# Altium schematic sheet LPCB219 - REFLECT SENSORS.SchDoc
size A3; Address1: Factory 10; Address2: 9-13 Dingley Avenue, Dandeong, VICTORIA 3175, AUSTRALIA; DocumentNumber: 6; Revision: 1; SheetNumber: 6; SheetTotal: 7; Lockie__PCB_SUB_ASSEMBLY: Reflect Sensors; Lockie__PCB_ASSEMBLY: Main; Lockie__LDL: LPCB219; Lockie__PCB_DESCRIPTION: Control Node
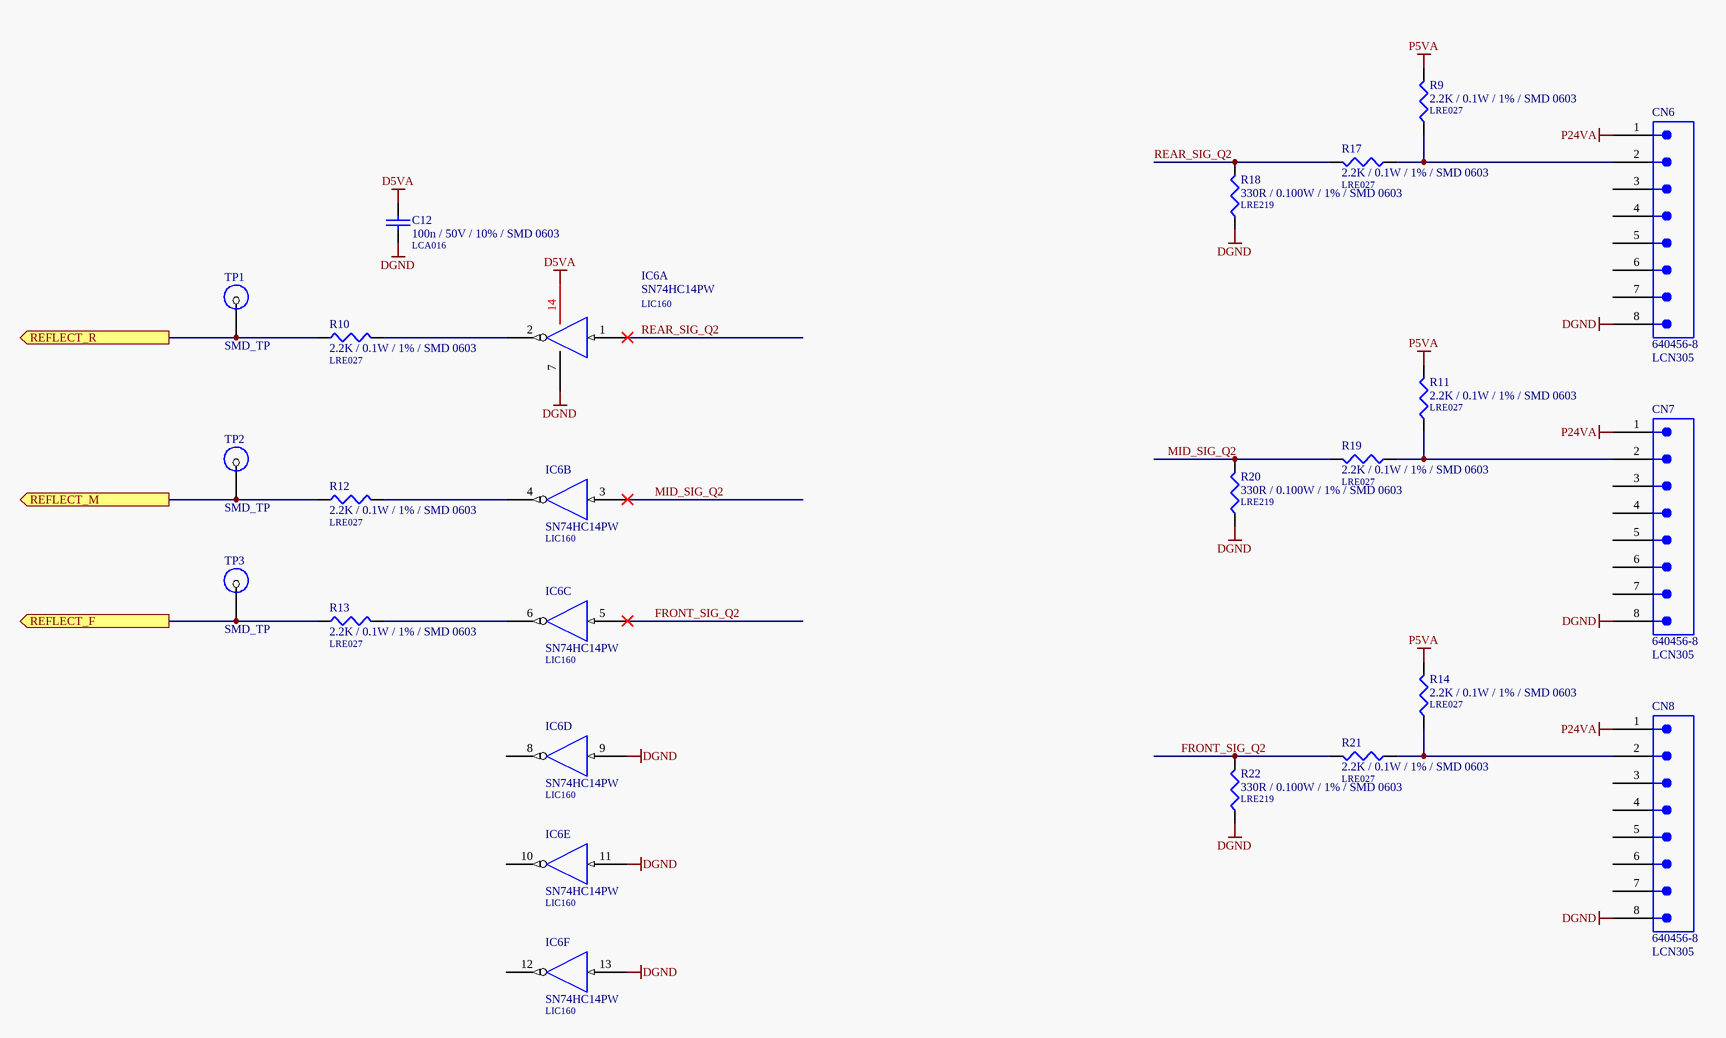
[diagram p0: LPCB219 - REFLECT SENSORS.SchDoc]

## Parts
C12  100n / 50V / 10% / SMD 0603  LDL_NUMBER: LCA016  [LFP011__CC1608-0603-IPC7351_B]
CN6  640456-8  LDL_NUMBER: LCN305  [640456-8]
CN7  640456-8  LDL_NUMBER: LCN305  [640456-8]
CN8  640456-8  LDL_NUMBER: LCN305  [640456-8]
IC6  SN74HC14PW  LDL_NUMBER: LIC160  [PW014]  (parts A,B,C,D,E,F of 6)
R9  2.2K / 0.1W / 1% / SMD 0603  LDL_NUMBER: LRE027  [LFP020__CR1608-0603-IPC7351_B]
R10  2.2K / 0.1W / 1% / SMD 0603  LDL_NUMBER: LRE027  [LFP020__CR1608-0603-IPC7351_B]
R11  2.2K / 0.1W / 1% / SMD 0603  LDL_NUMBER: LRE027  [LFP020__CR1608-0603-IPC7351_B]
R12  2.2K / 0.1W / 1% / SMD 0603  LDL_NUMBER: LRE027  [LFP020__CR1608-0603-IPC7351_B]
R13  2.2K / 0.1W / 1% / SMD 0603  LDL_NUMBER: LRE027  [LFP020__CR1608-0603-IPC7351_B]
R14  2.2K / 0.1W / 1% / SMD 0603  LDL_NUMBER: LRE027  [LFP020__CR1608-0603-IPC7351_B]
R17  2.2K / 0.1W / 1% / SMD 0603  LDL_NUMBER: LRE027  [LFP020__CR1608-0603-IPC7351_B]
R18  330R / 0.100W / 1% / SMD 0603  LDL_NUMBER: LRE219  [LFP020__CR1608-0603-IPC7351_B]
R19  2.2K / 0.1W / 1% / SMD 0603  LDL_NUMBER: LRE027  [LFP020__CR1608-0603-IPC7351_B]
R20  330R / 0.100W / 1% / SMD 0603  LDL_NUMBER: LRE219  [LFP020__CR1608-0603-IPC7351_B]
R21  2.2K / 0.1W / 1% / SMD 0603  LDL_NUMBER: LRE027  [LFP020__CR1608-0603-IPC7351_B]
R22  330R / 0.100W / 1% / SMD 0603  LDL_NUMBER: LRE219  [LFP020__CR1608-0603-IPC7351_B]
TP1  SMD_TP  [SMD-TP]  (no BOM)
TP2  SMD_TP  [SMD-TP]  (no BOM)
TP3  SMD_TP  [SMD-TP]  (no BOM)

## Ports
REFLECT_F (out), REFLECT_M (out), REFLECT_R (out)

## Nets
D5VA: C12.1 IC6.14(VCC)
DGND: C12.2 CN6.8 CN7.8 CN8.8 IC6.7(GND) IC6.9(A) IC6.11(A) IC6.13(A) R18.1 R20.1 R22.1
P5VA: R9.2 R11.2 R14.2
P24VA: CN6.1 CN7.1 CN8.1
FRONT_SIG_Q2: IC6.5(A) R21.2 R22.2
MID_SIG_Q2: IC6.3(A) R19.2 R20.2
REAR_SIG_Q2: IC6.1(A) R17.2 R18.2
REFLECT_F: R13.1 TP3.1 ; port REFLECT_F
REFLECT_M: R12.1 TP2.1 ; port REFLECT_M
REFLECT_R: R10.1 TP1.1 ; port REFLECT_R
NetCN6_2: CN6.2 R9.1 R17.1
NetCN7_2: CN7.2 R11.1 R19.1
NetCN8_2: CN8.2 R14.1 R21.1
NetIC6_2: IC6.2(Y) R10.2
NetIC6_4: IC6.4(Y) R12.2
NetIC6_6: IC6.6(Y) R13.2

Not connected (* = marked no-connect by the designer): CN6 3 4 5 6 7; CN7 3 4 5 6 7; CN8 3 4 5 6 7; IC6 8(Y) 10(Y) 12(Y)

## Notes on the sheet
- PCB COMPONENT DESCRIPTION
- LDL NUMBER
- Assembly Details
- Size
- Drawing File Name
- Revision
- http://rloop.org
- Scale
- A3
- Sheet Details
- N.T.S
- Sheet:
- Of:

## Library data of the parts
C12 = 100n / 50V / 10% / SMD 0603: Capacitor, Ceramic Chip, 100nF (0.1uF), 50V, 5%, SMD 0603 [LCA016]; FMEDA__OPERATING__VOLTAGE_MIN: 0; FMEDA__OPERATING__VOLTAGE_MAX: 3.3; FMEDA__OPERATING__TEMP_MIN: -20; FMEDA__OPERATING__TEMP_TYP: 27; FMEDA__OPERATING__TEMP_MAX: 50; FMEDA__CHANNEL: COM; Value: 100n; FMEDA__FUNCTION_IN_SYSTEM: *; FMEDA__OPERATING__VOLTAGE_TYP: 3.3
CN6-CN8 = 640456-8: Connector, Male Header, 8 Way; FMEDA__CHANNEL: COM; FMEDA__OPERATING__CURRENT_MAX: 0; FMEDA__OPERATING__TEMP_MAX: 50; FMEDA__OPERATING__TEMP_MIN: -20; FMEDA__OPERATING__TEMP_TYP: 27; FMEDA__OPERATING__VOLTAGE_MAX: 16; FMEDA__OPERATING__VOLTAGE_TYP: 12; FMEDA__FUNCTION_IN_SYSTEM: *; FMEDA__OPERATING__CURRENT_MIN: 0; FMEDA__OPERATING__CURRENT_TYP: 0; FMEDA__OPERATING__VOLTAGE_MIN: 0
IC6 = SN74HC14PW: IC, Hex Inveter, Schmitt Trigger, SMD [LIC160]; FMEDA__OPERATING__TEMP_MAX: 50; FMEDA__OPERATING__TEMP_MIN: -20; FMEDA__OPERATING__TEMP_TYP: 27; FMEDA__CHANNEL: COM; Revision: 17-Jul-2002: Re-released for DXP Platform.
R9-R14 R17 R19 R21 = 2.2K / 0.1W / 1% / SMD 0603: Resistor, Ceramic Chip, 2.2K, 0.1W, 1%, SMD 0603 [LRE027]; FMEDA__OPERATING__VOLTAGE_MIN: 0; FMEDA__OPERATING__TEMP_MIN: -20; FMEDA__OPERATING__TEMP_TYP: 27; FMEDA__OPERATING__TEMP_MAX: 50; FMEDA__CHANNEL: COM; VALUE: 2.2K; FMEDA__OPERATING__VOLTAGE_MAX: 0; FMEDA__OPERATING__POWER_MIN: 0; FMEDA__OPERATING__POWER_MAX: 0; FMEDA__FUNCTION_IN_SYSTEM: *; FMEDA__OPERATING__VOLTAGE_TYP: 0
R18 R20 R22 = 330R / 0.100W / 1% / SMD 0603: Resistor, Thick Film, 330R, 0.100W, 75V, 1%, SMD 0603 [LRE219]; VALUE: 330; FMEDA__OPERATING__POWER_MAX: 0.1; FMEDA__OPERATING__POWER_MIN: 0; FMEDA__OPERATING__VOLTAGE_MAX: 75; FMEDA__OPERATING__TEMP_MAX: 155; FMEDA__OPERATING__TEMP_MIN: -55; FMEDA__OPERATING__TEMP_TYP: 27; FMEDA__CHANNEL: COM; FMEDA__OPERATING__VOLTAGE_MIN: 0; FMEDA__OPERATING__VOLTAGE_TYP: 75; FMEDA__FUNCTION_IN_SYSTEM: *
TP1-TP3 = SMD_TP: SMD Test Point; FMEDA__CHANNEL: COM; FMEDA__OPERATING__CURRENT_MAX: 0; FMEDA__OPERATING__TEMP_MAX: 50; FMEDA__OPERATING__TEMP_MIN: -20; FMEDA__OPERATING__TEMP_TYP: 27; FMEDA__OPERATING__VOLTAGE_MAX: 16; FMEDA__OPERATING__VOLTAGE_TYP: 12; FMEDA__OPERATING__CURRENT_MIN: 0; FMEDA__OPERATING__CURRENT_TYP: 0; FMEDA__OPERATING__VOLTAGE_MIN: 0